# Altium schematic sheet Periphery.SchDoc
size A4; SheetNumber: 3; SheetTotal: 3
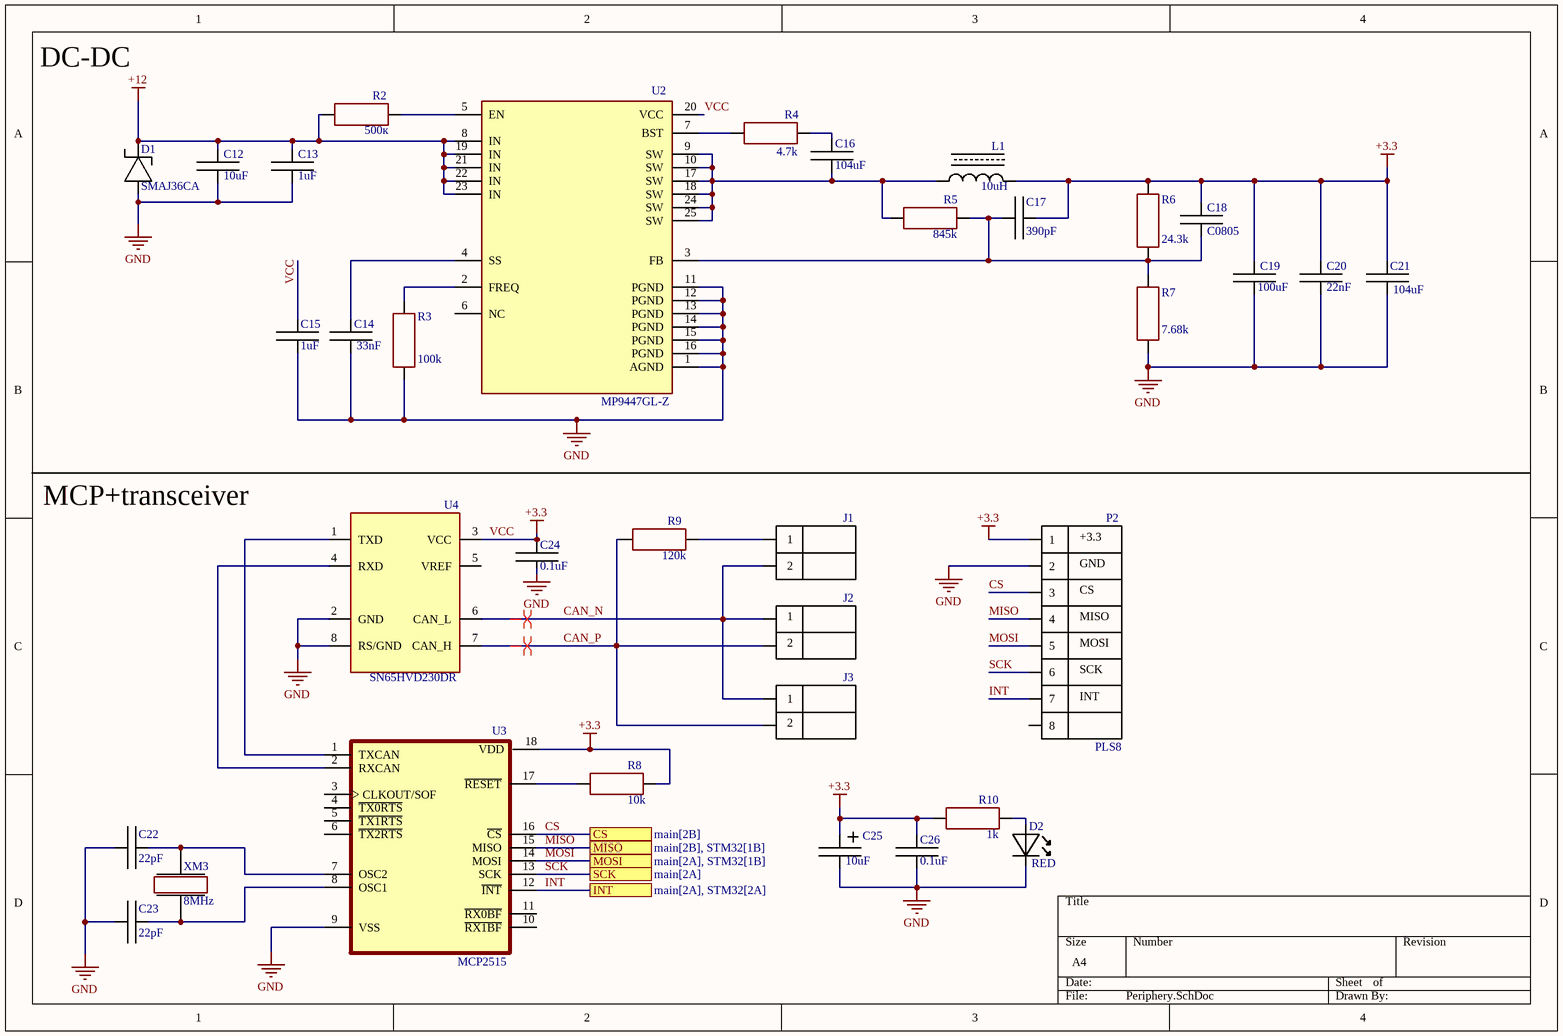
[diagram p0: Periphery.SchDoc]

## Parts
C12  10uF  [C0805]
C13  1uF  [C0805]
C15  1uF  [C0805]
C16  104uF  [C0805]
C17  390pF  [C0805]
C18  C0805  [C0805]
C19  100uF  [C0805]
C20  22nF  [C0805]
C21  104uF  [C0805]
C22  22pF  [C0805]
C23  22pF  [C0805]
C24  0.1uF  [C0805]
C25  10uF  [CAP_3.5 (8x12мм)]
C26  0.1uF  [C0805]
D1  SMAJ36CA  [SMAJ36CA]
D2  RED  [LED0805]
J1  PLS2  (value not drawn)
J2  PLS2  (value not drawn)
J3  PLS2  (value not drawn)
L1  10uH  [Inductor 10uH 8A]
P2  PLS8  [PLS8]
R2  500к  [R0805]
R3  100k  [R0805]
R4  4.7k  [R0805]
R5  845k  [R0805]
R6  24.3k  [R0805]
R7  7.68k  [R0805]
R8  10k  [R0805]
R9  120k  [R0805]
R10  1k  [R0805]
U2  MP9447GL-Z  [MP9447GL-Z]
U3  MCP2515  [MCP2515]
U4  SN65HVD230DR  [SN65HVD230DR]
XM3  8MHz  [Resonator]
С14  33nF  [C0805]

## Ports
CS (see main[2B]), INT (see main[2A], STM32[2A]), MISO (see main[2B], STM32[1B]), MOSI (see main[2A], STM32[1B]), SCK (see main[2A])

## Nets
+12: C12.2 C13.2 D1.2 R2.1 U2.8(IN) U2.19(IN) U2.21(IN) U2.22(IN) U2.23(IN)
GND: C12.1 C13.1 C15.1 C19.1 C20.1 C21.1 C22.1 C23.1 C24.1 C25.2 C26.1 D1.1 D2.C P2.2 R3.1 R7.1 U2.1(AGND) U2.11(PGND) U2.12(PGND) U2.13(PGND) U2.14(PGND) U2.15(PGND) U2.16(PGND) U3.9(VSS) U4.2(GND) U4.8(RS/GND) С14.1
VCC: C15.2 C17.2 C18.2 C19.2 C20.2 C21.2 C24.2 C25.1 C26.2 L1.1 P2.1 R6.2 R8.2 R10.1 U2.20(VCC) U3.18(VDD) U4.3(VCC)  [also labelled +3.3]
CAN_N: J1.1 J2.2 J3.2 U4.6(CAN_L)
CAN_P: J2.1 J3.1 R9.1 U4.7(CAN_H)
CS: P2.3 U3.16(~{CS}) ; port CS
INT: P2.7 U3.12(~{INT}) ; port INT
MISO: P2.4 U3.15(MISO) ; port MISO
MOSI: P2.5 U3.14(MOSI) ; port MOSI
SCK: P2.6 U3.13(SCK) ; port SCK
NetC16_1: C16.1 L1.2 R5.1 U2.9(SW) U2.10(SW) U2.17(SW) U2.18(SW) U2.24(SW) U2.25(SW)
NetC16_2: C16.2 R4.2
NetC17_1: C17.1 C18.1 R5.2 R6.1 R7.2 U2.3(FB)
NetC22_2: C22.2 U3.7(OSC2) XM3.2
NetC23_2: C23.2 U3.8(OSC1) XM3.1
NetD2_A: D2.A R10.2
NetJ1_2: J1.2 R9.2
NetR2_2: R2.2 U2.5(EN)
NetR3_2: R3.2 U2.2(FREQ)
NetR4_1: R4.1 U2.7(BST)
NetR8_1: R8.1 U3.17(~{RESET})
NetU2_4: U2.4(SS) С14.2
NetU3_1: U3.1(TXCAN) U4.1(TXD)
NetU3_2: U3.2(RXCAN) U4.4(RXD)

Not connected (* = marked no-connect by the designer): P2 8; U2 6(NC); U3 3(CLKOUT/SOF) 4(~{TX0RTS}) 5(~{TX1RTS}) 6(~{TX2RTS}) 10(~{RX1BF}) 11(~{RX0BF}); U4 5(VREF)

## Layout directives
differential pair: CAN_N, CAN_P

## Notes on the sheet
- DC-DC
- MCP+transceiver
- (near J1) 1
- (near J1) 2
- (near P2) +3.3
- (near P2) GND
- (near J2) 1
- (near J2) 2
- (near P2) CS
- (near P2) MISO
- (near P2) MOSI
- (near J3) 1
- (near P2) SCK
- (near P2) INT
- (near J3) 2

## Library data of the parts
C12 C13 C15-C24 C26 С14 = C0805: Керамический конденсатор. 1uF,10uF,106uF,33pF,100uF
C25 = C_3.5: Электролит конденсатор (8x12мм)
D1 = SMAJ36CA: TVS-диод (Transient Voltage Suppressor)Рабочее напряжение (stand-off): 36 В / Пробой: ~40–44 В / Ограничение (clamping): ~58 В / Импульсная мощность: 400 Вт / Тип: двунаправленный (CA)
D2 = Led: SMD 0805
L1 = Inductor SMD: Катушка индуктивности SMD экранированная 10мкГн +20% 6,8A 36,5мОм 4040 лента на катушке. name-IHLP4040DZER100M01
R2-R10 = R0805: SMD
U2 = MP9447GL-Z: Микросхема понижающего импульсного стабилизатора напряжения (Buck Switching Regulator IC), регулировка положительного напряжения 0,8 В, 1 выход, 5 А, 20-VFQFN, открытая контактная площадка.
U3 = MCP2515: MCP2515-I/SO
U4 = SN65HVD230DR: трансивер, 1Мбит/с, 3-3,6ВDC, SO8
XM3 = Resonator